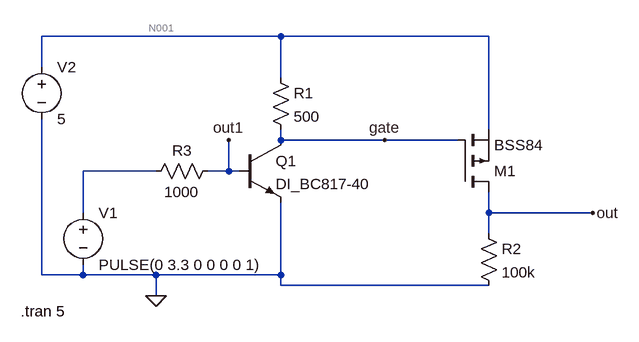
[diagram p0: schematic output_sim.asc]
output_sim.asc, the LTspice schematic file:
Version 4
SHEET 1 880 680
WIRE 224 -144 -144 -144
WIRE 544 -144 224 -144
WIRE -144 -96 -144 -144
WIRE 224 -80 224 -144
WIRE 544 0 544 -144
WIRE 224 16 224 0
WIRE 384 16 224 16
WIRE 496 16 384 16
WIRE 32 64 -80 64
WIRE 144 64 144 16
WIRE 144 64 112 64
WIRE 160 64 144 64
WIRE -80 128 -80 64
WIRE 544 128 544 96
WIRE 704 128 544 128
WIRE 544 160 544 128
WIRE -144 224 -144 -16
WIRE -80 224 -80 208
WIRE -80 224 -144 224
WIRE 32 224 -80 224
WIRE 224 224 224 112
WIRE 224 224 32 224
WIRE 224 240 224 224
WIRE 544 240 224 240
WIRE 32 256 32 224
FLAG 32 256 0
FLAG 704 128 out
FLAG 144 16 out1
FLAG 384 16 gate
SYMBOL voltage -80 112 R0
WINDOW 123 0 0 Left 0
WINDOW 39 0 0 Left 0
SYMATTR InstName V1
SYMATTR Value PULSE(0 3.3 0 0 0 0 1)
SYMBOL res 208 -96 R0
SYMATTR InstName R1
SYMATTR Value 500
SYMBOL res 528 144 R0
SYMATTR InstName R2
SYMATTR Value 100k
SYMBOL res 128 48 R90
WINDOW 0 0 56 VBottom 2
WINDOW 3 32 56 VTop 2
SYMATTR InstName R3
SYMATTR Value 1000
SYMBOL npn 160 16 R0
SYMATTR InstName Q1
SYMATTR Value DI_BC817-40
SYMBOL pmos 496 96 M180
SYMATTR InstName M1
SYMATTR Value BSS84
SYMBOL voltage -144 -112 R0
WINDOW 123 0 0 Left 0
WINDOW 39 0 0 Left 0
SYMATTR InstName V2
SYMATTR Value 5
TEXT -176 280 Left 2 !.tran 5

The netlist it stands for:
* output_sim.asc
V1 N002 0 PULSE(0 3.3 0 0 0 0 1)
R1 N001 gate 500
R2 out 0 100k
R3 out1 N002 1000
Q1 gate out1 0 0 DI_BC817-40
M1 out gate N001 N001 BSS84
V2 N001 0 5
.model NPN NPN
.model PNP PNP
.lib standard.bjt
.model NMOS NMOS
.model PMOS PMOS
.lib standard.mos
.tran 5
.backanno
.end

* Results of the author's LTspice run, read from the files saved beside the schematic
* Operating Point, zero values left out:
*   V(n001) = 5 V
*   V(gate) = 5 V
*   V(out) = 1.2 µV
*   V(out1) = 1.015 µV
*   Ic(Q1) = 5.222 nA
*   Ib(Q1) = -1.015 nA
*   Ie(Q1) = -4.207 nA
*   Id(M1) = -7 pA
*   Is(M1) = 7 pA
*   I(R3) = 1.015 nA
*   I(R2) = 12 pA
*   I(R1) = 5.222 nA
*   I(V2) = -5.234 nA
*   I(V1) = 1.015 nA
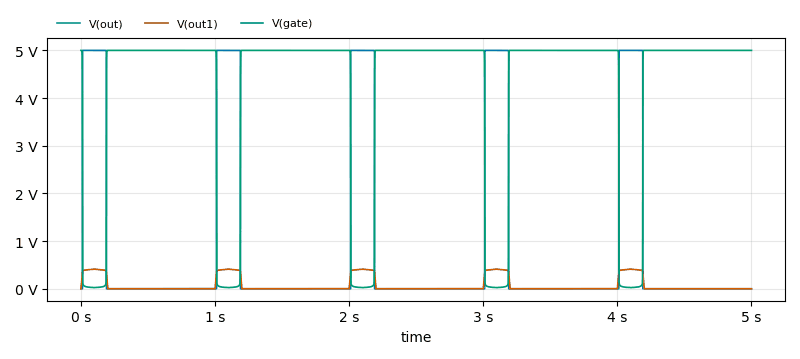
[diagram p1: Transient Analysis of output_sim.asc, plotted from the saved traces]
* Transient Analysis, 1 run:
*   V(out): min -922.4 µV, max 5 V, average 889.5 mV, rms 2.109 V, last 1.195 µV
*   V(out1): min -110.8 nV, max 410.9 mV, average 74.96 mV, rms 171.1 mV, last 1.015 µV
*   V(gate): min 24.98 mV, max 5 V, average 4.118 V, rms 4.531 V, last 5 V